# Altium schematic sheet USB Interface.SchDoc
size Tabloid
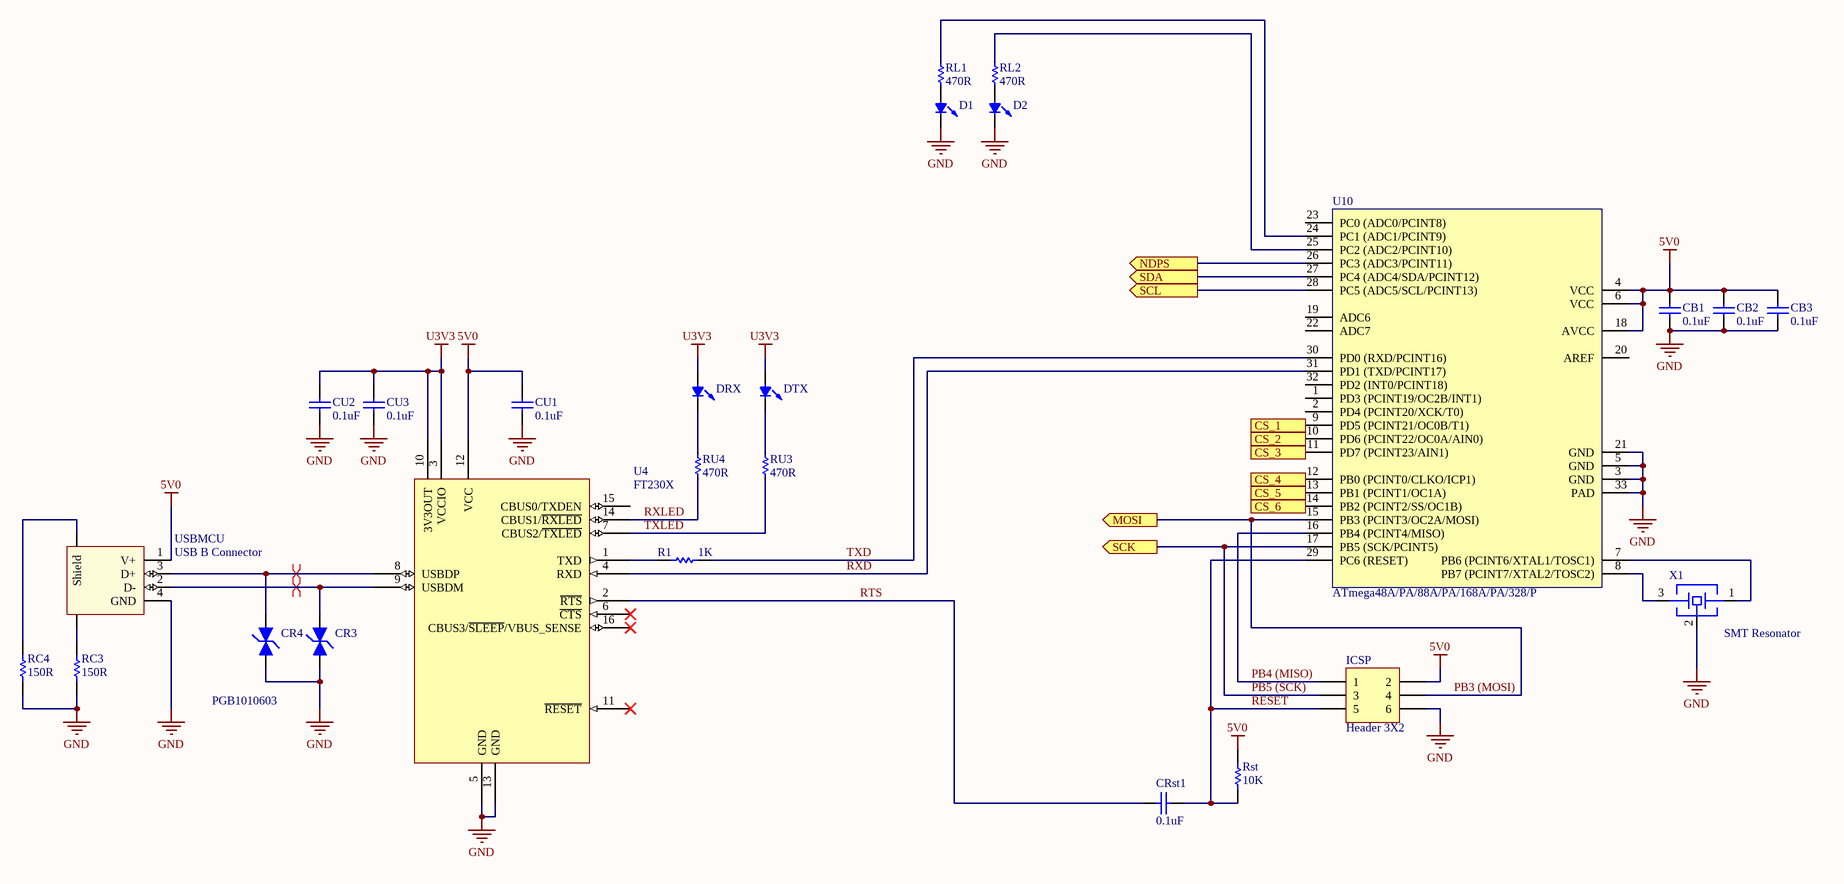
[diagram p0: USB Interface.SchDoc]

## Parts
CB1  value 0.1uF  [0603C]  (hidden comment: Cap Semi)
CB2  value 0.1uF  [0603C]  (hidden comment: Cap Semi)
CB3  value 0.1uF  [0603C]  (hidden comment: Cap Semi)
CR3  PGB1010603  [0603PG]  (value not drawn)
CR4  PGB1010603  [0603PG]
CRst1  value 0.1uF  [0603C]  (hidden comment: Cap Semi)
CU1  value 0.1uF  [0603C]  (hidden comment: Cap Semi)
CU2  value 0.1uF  [0603C]  (hidden comment: Cap Semi)
CU3  value 0.1uF  [0603C]  (hidden comment: Cap Semi)
D1  LED0  [T1 LED]  (value not drawn)
D2  LED0  [T1 LED]  (value not drawn)
DRX  LED0  [T1 LED]  (value not drawn)
DTX  LED0  [T1 LED]  (value not drawn)
ICSP  Header 3X2  [HDR2X3]
R1  value 1K  [0603R]  (hidden comment: Res Semi)
RC3  value 150R  [1206R]  (hidden comment: Res Semi)
RC4  value 150R  [1206R]  (hidden comment: Res Semi)
RL1  value 470R  [0603R]  (hidden comment: Res Semi Small)
RL2  value 470R  [0603R]  (hidden comment: Res Semi Small)
Rst  value 10K  [0603R]  (hidden comment: Res Semi)
RU3  value 470R  [0603R]  (hidden comment: Res Semi Small)
RU4  value 470R  [0603R]  (hidden comment: Res Semi Small)
U4  FT230X  [SOP635P600-16AN]
U10  ATmega48A/PA/88A/PA/168A/PA/328/P  [TQFP80P900X900X120-32N]
USBMCU  USB B Connector  [USB Connector (type B)]
X1  SMT Resonator  [CSTCE_V]

## Ports
CS_1 (out), CS_2 (out), CS_3 (out), CS_4 (out), CS_5 (out), CS_6 (out), MOSI (out), NDPS (out), SCK (out), SCL (out), SDA (out)

## Nets
5V0: CB1.2 CB2.2 CB3.2 CU1.2 ICSP.2 Rst.2 U4.12(VCC) U10.4(VCC) U10.6(VCC) U10.18(AVCC) USBMCU.1(V+)
GND: CB1.1 CB2.1 CB3.1 CR3.2 CR4.2 CU1.1 CU2.1 CU3.1 D1.2 D2.2 ICSP.6 RC3.1 RC4.1 U4.5(GND) U4.13(GND) U10.3(GND) U10.5(GND) U10.21(GND) U10.33(PAD) USBMCU.4(GND) X1.2
U3V3: CU2.2 CU3.2 DRX.1 DTX.1 U4.3(VCCIO) U4.10(3V3OUT)
~{RESET}: CRst1.2 ICSP.5 Rst.1 U10.29(PC6_(RESET))
CS_1: U10.9(PD5_(PCINT21/OC0B/T1)) ; port CS_1
CS_2: U10.10(PD6_(PCINT22/OC0A/AIN0)) ; port CS_2
CS_3: U10.11(PD7_(PCINT23/AIN1)) ; port CS_3
CS_4: U10.12(PB0_(PCINT0/CLKO/ICP1)) ; port CS_4
CS_5: U10.13(PB1_(PCINT1/OC1A)) ; port CS_5
CS_6: U10.14(PB2_(PCINT2/SS/OC1B)) ; port CS_6
NDPS: U10.26(PC3_(ADC3/PCINT11)) ; port NDPS
PB3 (MOSI): ICSP.4 U10.15(PB3_(PCINT3/OC2A/MOSI)) ; port MOSI
PB4 (MISO): ICSP.1 U10.16(PB4_(PCINT4/MISO))
PB5 (SCK): ICSP.3 U10.17(PB5_(SCK/PCINT5)) ; port SCK
RTS: CRst1.1 U4.2(~{RTS})
RXD: U4.4(RXD) U10.31(PD1_(TXD/PCINT17))
RXLED: RU4.2 U4.14(CBUS1/~{RXLED})
SCL: U10.28(PC5_(ADC5/SCL/PCINT13)) ; port SCL
SDA: U10.27(PC4_(ADC4/SDA/PCINT12)) ; port SDA
TXD: R1.2 U10.30(PD0_(RXD/PCINT16))
TXLED: RU3.2 U4.7(CBUS2/~{TXLED})
NetCR3_1: CR3.1 U4.9(USBDM) USBMCU.2(D-)
NetCR4_1: CR4.1 U4.8(NC) USBMCU.3(D+)
NetD1_1: D1.1 RL1.2
NetD2_1: D2.1 RL2.2
NetDRX_2: DRX.2 RU4.1
NetDTX_2: DTX.2 RU3.1
NetR1_1: R1.1 U4.1(TXD)
NetRC3_2: RC3.2 USBMCU.5(Gnd)
NetRC4_2: RC4.2 USBMCU.6(Shield)
NetRL1_1: RL1.1 U10.24(PC1_(ADC1/PCINT9))
NetRL2_1: RL2.1 U10.25(PC2_(ADC2/PCINT10))
NetU10_7: U10.7(PB6_(PCINT6/XTAL1/TOSC1)) X1.1
NetU10_8: U10.8(PB7_(PCINT7/XTAL2/TOSC2)) X1.3

Not connected (* = marked no-connect by the designer): U4 6(~{CTS})* 11(~{RESET})* 15(CBUS0/TXDEN) 16(CBUS3/~{SLEEP}/VBUS_SENSE)* 24(NC); U10 1(PD3_(PCINT19/OC2B/INT1)) 2(PD4_(PCINT20/XCK/T0)) 19(ADC6) 20(AREF) 22(ADC7) 23(PC0_(ADC0/PCINT8)) 32(PD2_(INT0/PCINT18))

## Layout directives
differential pair: NetCR3_1, NetCR4_1

## Library data of the parts
CB1-CB3 CRst1 CU1-CU3 = Cap Semi: Capacitor (Semiconductor SIM Model); Published: 8-Jun-2000; LatestRevisionDate: 17-Jul-2002; LatestRevisionNote: Re-released for DXP Platform.; PackageReference: C1206; Publisher: Altium Limited
CR3 CR4 = PGB1010603: PulseGuard® Lead-Free 0603 Surface Mount Polymeric ESD Suppressors
D1 D2 DRX DTX = LED0: T 1 3/4 LED; Published: 8-Jun-2000; LatestRevisionDate: 08-Jul-2005; LatestRevisionNote: Mech Layer 1 removed.; PackageReference: LED-0; Publisher: Altium Limited
ICSP = Header 3X2: Header, 3-Pin, Dual row; LatestRevisionDate: 17-Jul-2002; LatestRevisionNote: Re-released for DXP Platform.; Publisher: Altium Limited
R1 RC3 RC4 Rst = Res Semi: Semiconductor Resistor; Published: 8-Jun-2000; LatestRevisionDate: 17-Jul-2002; LatestRevisionNote: Re-released for DXP Platform.; PackageReference: AXIAL-0.5; Publisher: Altium Limited
RL1 RL2 RU3 RU4 = Res Semi Small: Semiconductor Resistor; Published: 8-Jun-2000; LatestRevisionDate: 17-Jul-2002; LatestRevisionNote: Re-released for DXP Platform.; PackageReference: AXIAL-0.5; Publisher: Altium Limited
U4 = FT230X: USB To Basic Serial Bridge IC; DKPN: 768-1135-1-ND; Datasheet: http://www.ftdichip.com/Support/Documents/DataSheets/ICs/DS_FT230X.pdf
U10 = ATmega48A/PA/88A/PA/168A/PA/328/P: Atmel 8-bit Microcontroller with 4/8/16/32KBytes In-  System Programmable Flash
USBMCU = USB B connector - Through hole
X1 = SMT Resonator: 16 MHz SMT Resonator; DKPN: 490-1198-1-ND; MFGPN: CSTCE16M0V53-R0; DKDESC: CER RESONATOR 16.0MHZ SMD